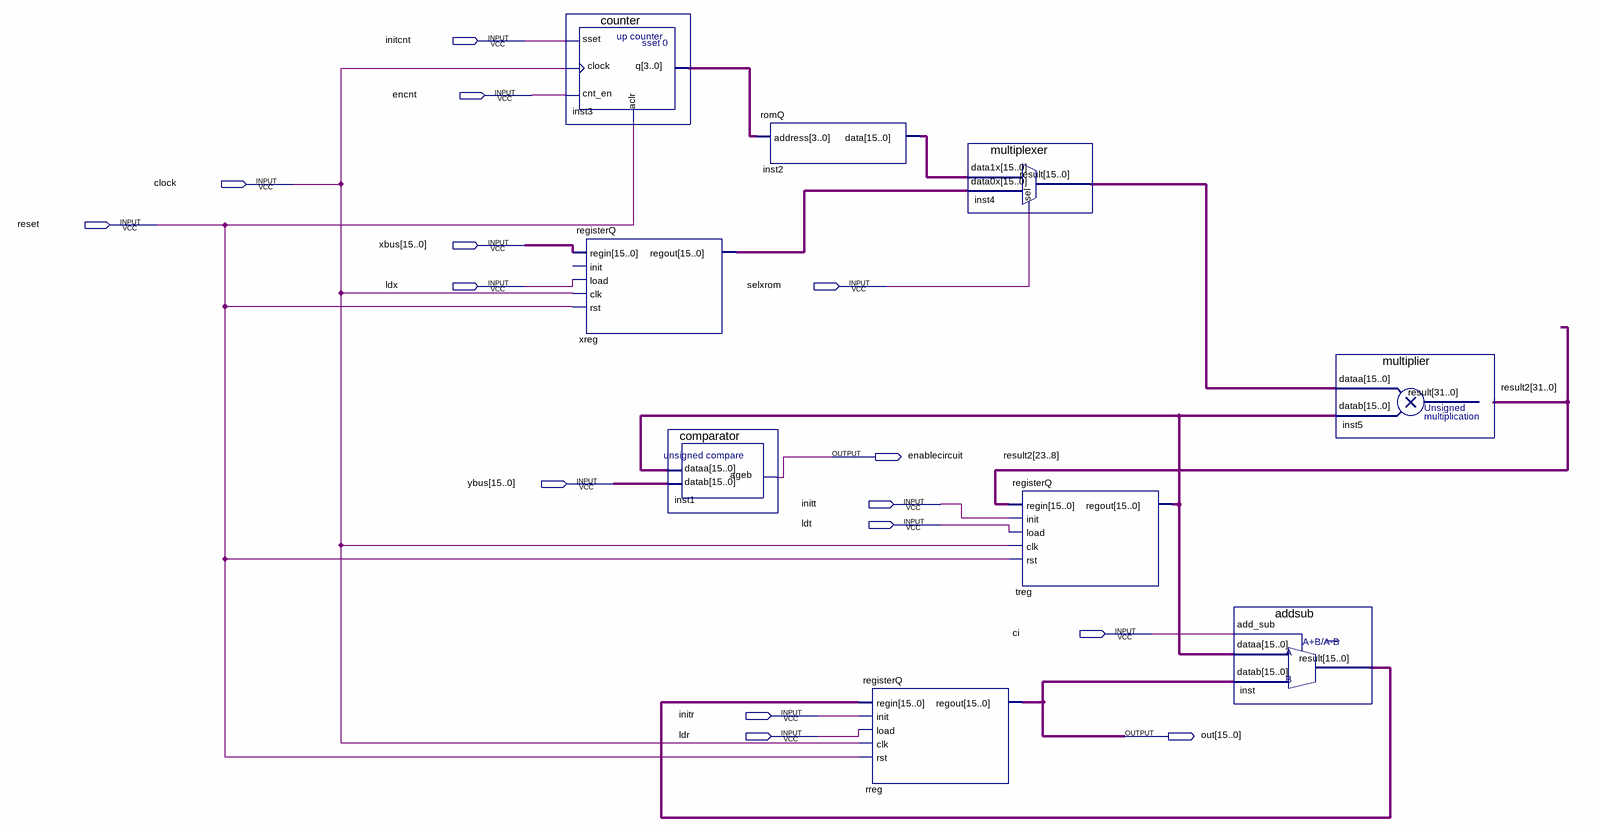
[diagram p0: schematic sheet]
// Quartus schematic datapathfinal.bdf as structural Verilog: 9 symbols, 15 pins
module datapathfinal (
  input  initcnt,
  input  encnt,
  input  clock,
  input  reset,
  input  [15:0] xbus,
  input  ldx,
  input  selxrom,
  input  [15:0] ybus,
  input  initt,
  input  ldt,
  input  ci,
  input  initr,
  input  ldr,
  output enablecircuit,
  output [15:0] out
);

  wire [3:0] inst3_q;
  wire [15:0] inst2_data, inst4_result, inst_result, treg_regout, xreg_regout;
  wire [31:0] result2;

  counter inst3 (.sset(initcnt), .clock(clock), .cnt_en(encnt), .aclr(reset), .q(inst3_q));
  registerQ xreg (.regin(xbus), .load(ldx), .clk(clock), .rst(reset), .regout(xreg_regout));  // open: init
  comparator inst1 (.dataa(treg_regout), .datab(ybus), .ageb(enablecircuit));
  romQ inst2 (.address(inst3_q), .data(inst2_data));
  registerQ rreg (.regin(inst_result), .init(initr), .load(ldr), .clk(clock), .rst(reset), .regout(out));
  multiplexer inst4 (.data1x(inst2_data), .data0x(xreg_regout), .sel(selxrom), .result(inst4_result));
  registerQ treg (.regin(result2[23:8]), .init(initt), .load(ldt), .clk(clock), .rst(reset), .regout(treg_regout));
  addsub inst (.add_sub(ci), .dataa(treg_regout), .datab(out), .result(inst_result));
  multiplier inst5 (.dataa(inst4_result), .datab(treg_regout), .result(result2));
endmodule
